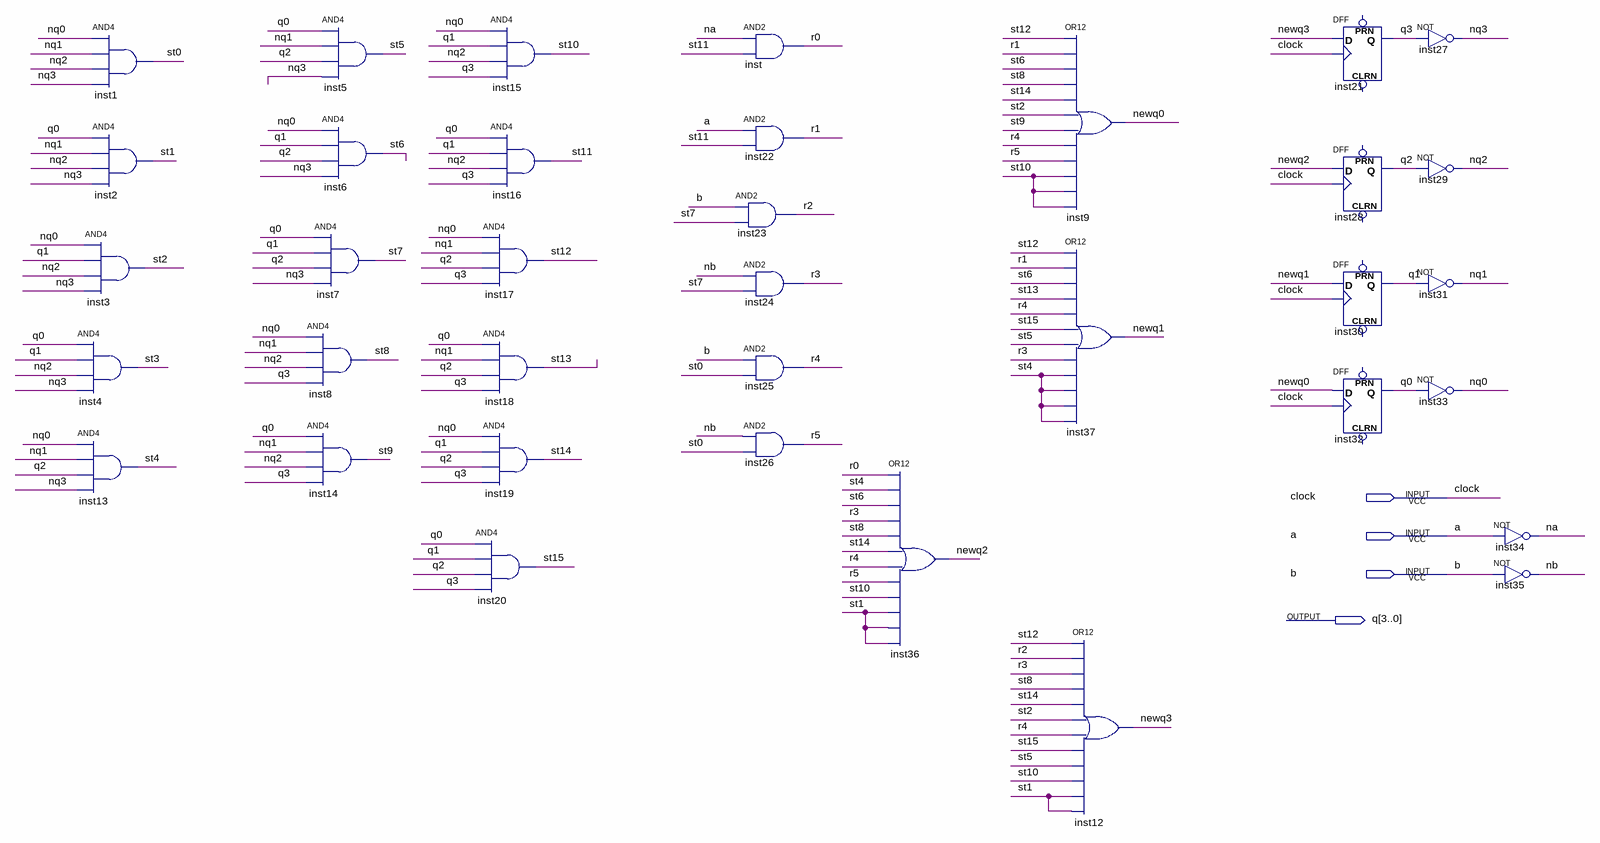
[diagram p0: schematic sheet]
// Quartus schematic counter.bdf as structural Verilog: 36 symbols, 4 pins
module counter (
  input  clock,
  input  a,
  input  b,
  output [3:0] q
);

  wire na, nb, newq0, newq1, newq2, newq3, nq0, nq1, nq2, nq3, r0, r1, r2, r3, r4, r5, st0, st1, st2, st3,
       st4, st5, st6, st7, st8, st9, st10, st11, st12, st13, st14, st15;

  and inst3 (st2, nq0, q[1], nq2, nq3);
  and inst4 (st3, q[0], q[1], nq2, nq3);
  and inst13 (st4, nq0, nq1, q[2], nq3);
  and inst1 (st0, nq0, nq1, nq2, nq3);
  and inst2 (st1, q[0], nq1, nq2, nq3);
  and inst5 (st5, q[0], nq1, q[2], nq3);
  and inst6 (st6, nq0, q[1], q[2], nq3);
  and inst7 (st7, q[0], q[1], q[2], nq3);
  and inst8 (st8, nq0, nq1, nq2, q[3]);
  and inst14 (st9, q[0], nq1, nq2, q[3]);
  and inst15 (st10, nq0, q[1], nq2, q[3]);
  and inst16 (st11, q[0], q[1], nq2, q[3]);
  and inst17 (st12, nq0, nq1, q[2], q[3]);
  and inst18 (st13, q[0], nq1, q[2], q[3]);
  and inst19 (st14, nq0, q[1], q[2], q[3]);
  and inst20 (st15, q[0], q[1], q[2], q[3]);
  and inst (r0, na, st11);
  and inst22 (r1, a, st11);
  and inst23 (r2, b, st7);
  and inst24 (r3, nb, st7);
  and inst25 (r4, b, st0);
  and inst26 (r5, nb, st0);
  or inst36 (newq2, r0, st4, st6, r3, st8, st14, r4, r5, st10, st1, st1, st1);
  or inst9 (newq0, st12, r1, st6, st8, st14, st2, st9, r4, r5, st10, st10, st10);
  or inst37 (newq1, st12, r1, st6, st13, r4, st15, st5, r3, st4, st4, st4, st4);
  or inst12 (newq3, st12, r2, r3, st8, st14, st2, r4, st15, st5, st10, st1, st1);
  DFF inst21 (.CLK(clock), .D(newq3), .Q(q[3]));  // open: CLRN, PRN
  DFF inst28 (.CLK(clock), .D(newq2), .Q(q[2]));  // open: CLRN, PRN
  DFF inst30 (.CLK(clock), .D(newq1), .Q(q[1]));  // open: CLRN, PRN
  DFF inst32 (.CLK(clock), .D(newq0), .Q(q[0]));  // open: CLRN, PRN
  not inst27 (nq3, q[3]);
  not inst29 (nq2, q[2]);
  not inst31 (nq1, q[1]);
  not inst33 (nq0, q[0]);
  not inst34 (na, a);
  not inst35 (nb, b);
endmodule
